# EAGLE schematic controller-r3 (EAGLE 6.6.0)
DATABASE: ./../../../../core/eagle/partsdb.txt

## Sheet 1 of 3
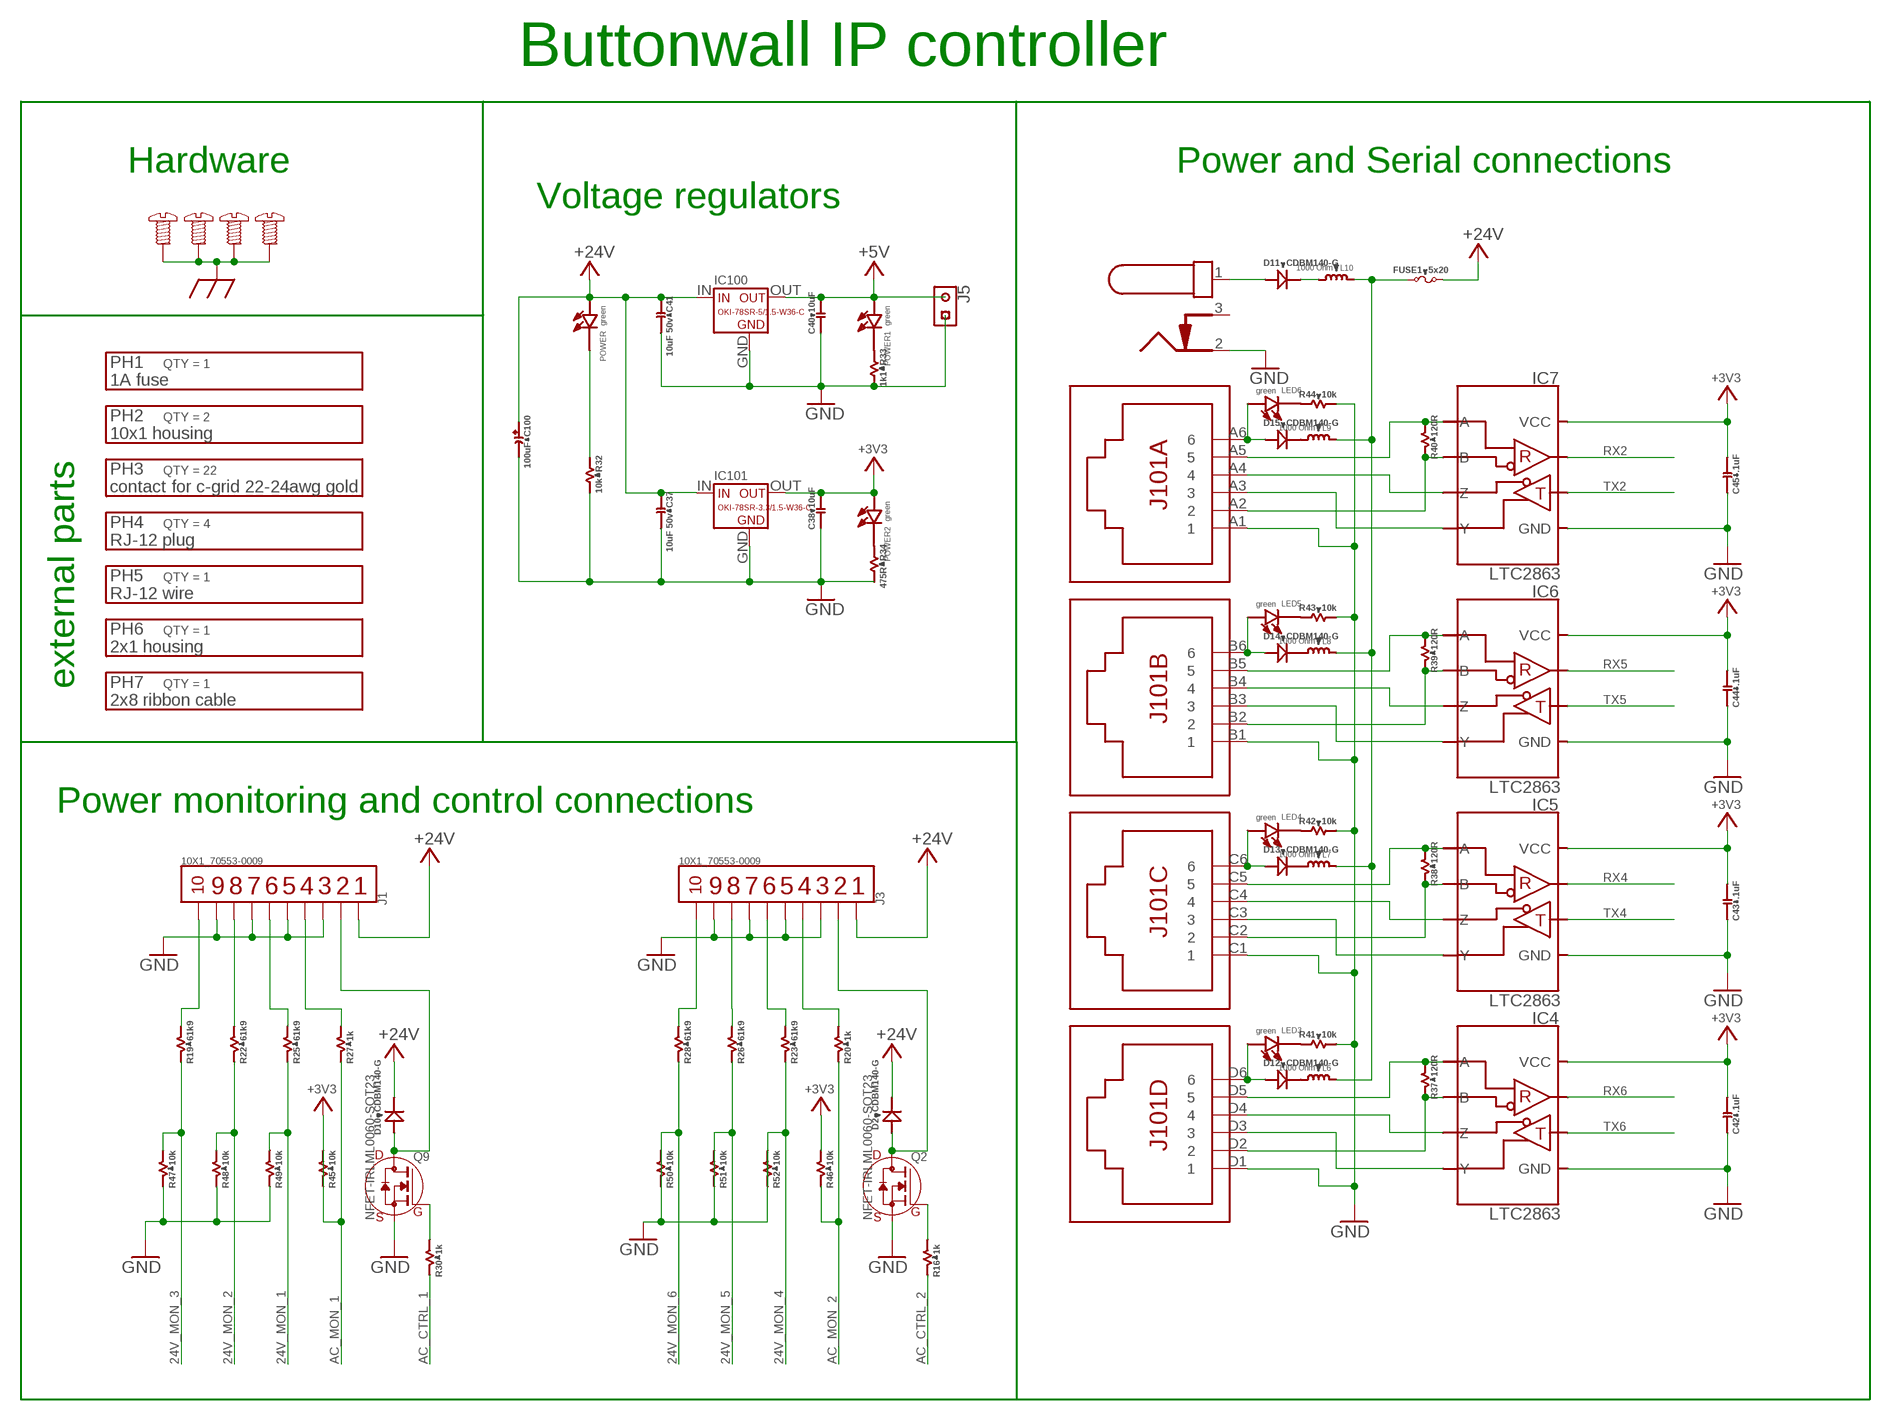
[diagram p0: schematic, sheet 1]
PH1 (BOM-PART): PARTNO: 0001.2504; QTY: 1
PH2 (BOM-PART): PARTNO: 0050579410; QTY: 2
PH3 (BOM-PART): PARTNO: 0016020103; QTY: 22
PH4 (BOM-PART): PARTNO: 940-SP-3066; QTY: 4
PH5 (BOM-PART): QTY: 1
PH6 (BOM-PART): PARTNO: 0050579402; QTY: 1
PH7 (BOM-PART): PARTNO: H3CCH-1606G; QTY: 1

### Parts
C37  10uF 50v  C1206  [C1206B]
C38  10uF  C0603  [C0603B]
C40  10uF  C0603  [C0603B]
C41  10uF 50v  C1206  [C1206B]
C42  .1uF  C0603  [C0603B]
C43  .1uF  C0603  [C0603B]
C44  .1uF  C0603  [C0603B]
C45  .1uF  C0603  [C0603B]
C100  100uF  CPOL-TH-3.5-8  [E3,5-8]
D2  CDBM140-G  D_SOD123  [SOD-123]
D10  CDBM140-G  D_SOD123  [SOD-123]
D11  CDBM140-G  D_SOD123  [SOD-123]
D12  CDBM140-G  D_SOD123  [SOD-123]
D13  CDBM140-G  D_SOD123  [SOD-123]
D14  CDBM140-G  D_SOD123  [SOD-123]
D15  CDBM140-G  D_SOD123  [SOD-123]
FUSE1  5x20  F-649  [649]
IC4  LTC2863  [SO08]
IC5  LTC2863  [SO08]
IC6  LTC2863  [SO08]
IC7  LTC2863  [SO08]
IC100  OKI-78SR-5/1.5-W36-C  [OKI-78SR-V]
IC101  OKI-78SR-3.3/1.5-W36-C  [OKI-78SR-V]
J1  10X1_70553-0009  [MOLEX_70553-(10)]
J3  10X1_70553-0009  [MOLEX_70553-(10)]
J5  1X2_70543  [MOLEX_70543-0001]
J100  PJ-102AH  DC_JACK  [PJ-102(DC_JACK)]
J101  RJ12-QUAD  [SS-666604-NF]
L6  1000 Ohm  L0603  [R0603B]
L7  1000 Ohm  L0603  [R0603B]
L8  1000 Ohm  L0603  [R0603B]
L9  1000 Ohm  L0603  [R0603B]
L10  1000 Ohm  L0603  [R0603B]
LED3  green  LED0603  [CHIPLED_0603]
LED4  green  LED0603  [CHIPLED_0603]
LED5  green  LED0603  [CHIPLED_0603]
LED6  green  LED0603  [CHIPLED_0603]
POWER  green  LED0603  [CHIPLED_0603]
POWER1  green  LED0603  [CHIPLED_0603]
POWER2  green  LED0603  [CHIPLED_0603]
Q2  NFET-IRLML0060-SOT23  [SOT-23]
Q9  NFET-IRLML0060-SOT23  [SOT-23]
R16  1k  R0603  [R0603B]
R19  61k9  R0603  [R0603B]
R20  1k  R0603  [R0603B]
R22  61k9  R0603  [R0603B]
R23  61k9  R0603  [R0603B]
R25  61k9  R0603  [R0603B]
R26  61k9  R0603  [R0603B]
R27  1k  R0603  [R0603B]
R28  61k9  R0603  [R0603B]
R30  1k  R0603  [R0603B]
R32  10k  R0603  [R0603B]
R33  1k1  R0603  [R0603B]
R34  475R  R0603  [R0603B]
R37  120R  R1206  [R1206B]
R38  120R  R1206  [R1206B]
R39  120R  R1206  [R1206B]
R40  120R  R1206  [R1206B]
R41  10k  R0603  [R0603B]
R42  10k  R0603  [R0603B]
R43  10k  R0603  [R0603B]
R44  10k  R0603  [R0603B]
R45  10k  R0603  [R0603B]
R46  10k  R0603  [R0603B]
R47  10k  R0603  [R0603B]
R48  10k  R0603  [R0603B]
R49  10k  R0603  [R0603B]
R50  10k  R0603  [R0603B]
R51  10k  R0603  [R0603B]
R52  10k  R0603  [R0603B]
SCREW1  SCREW-632-0-PSHP  [SMTPR-6-1]
SCREW2  SCREW-632-0-PSHP  [SMTPR-6-1]
SCREW3  SCREW-632-0-PSHP  [SMTPR-6-1]
SCREW4  SCREW-632-0-PSHP  [SMTPR-6-1]

### Nets
24V_MON_1: R25.1 R49.2 ; also sheet 2
24V_MON_2: R22.1 R48.2 ; also sheet 2
24V_MON_3: R19.1 R47.2 ; also sheet 2
24V_MON_4: R23.1 R52.1 ; also sheet 2
24V_MON_5: R26.1 R51.1 ; also sheet 2
24V_MON_6: R28.1 R50.1 ; also sheet 2
+3V3: C38.2 C42.2 C43.2 C44.2 C45.2 IC4.1(VCC) IC5.1(VCC) IC6.1(VCC) IC7.1(VCC) IC101.OUT POWER2.A(ANODE) R45.1 R46.2 ; also sheet 2,3
+5V: C40.2 IC100.OUT J5.2 POWER1.A(ANODE)
+24V: C37.1 C41.1 C100.+ D2.C(K) D10.C(K) FUSE1.2 IC100.IN IC101.IN J1.1 J3.1 POWER.A(ANODE)
AC_CTRL_1: R30.1 ; also sheet 2
AC_CTRL_2: R16.1 ; also sheet 2
AC_MON_1: R27.1 R45.2 ; also sheet 2
AC_MON_2: R20.1 R46.1 ; also sheet 2
CHASSIS [Earth]: SCREW1.P$1 SCREW2.P$1 SCREW3.P$1 SCREW4.P$1 ; also sheet 3
GND: C37.2 C38.1 C40.1 C41.2 C42.1 C43.1 C44.1 C45.1 C100.- IC4.4(GND) IC5.4(GND) IC6.4(GND) IC7.4(GND) IC100.GND IC101.GND J1.3 J1.5 J1.7 J1.9 J3.3 J3.5 J3.7 J3.9 J5.1 J100.2(SLEEVE) J101.A1 J101.B1 J101.C1 J101.D1 Q2.2(S) Q9.2(S) R32.2 R33.2 R34.2 R41.2 R42.2 R43.2 R44.2 R47.1 R48.1 R49.1 R50.2 R51.2 R52.2 ; also sheet 2,3
N$7: IC7.7(B) J101.A2 R40.1
N$17: POWER1.C(CATHODE) R33.1
N$22: IC7.8(A) J101.A5 R40.2
N$23: D15.C(K) L9.2
N$24: POWER.C(CATHODE) R32.1
N$25: IC7.5(Y) J101.A3
N$29: IC7.6(Z) J101.A4
N$32: IC6.7(B) J101.B2 R39.1
N$36: IC6.8(A) J101.B5 R39.2
N$38: D15.A J101.A6 LED6.A(ANODE)
N$39: IC6.5(Y) J101.B3
N$40: IC6.6(Z) J101.B4
N$41: IC5.7(B) J101.C2 R38.1
N$43: IC5.8(A) J101.C5 R38.2
N$44: D14.C(K) L8.2
N$45: IC5.5(Y) J101.C3
N$46: IC5.6(Z) J101.C4
N$47: IC4.7(B) J101.D2 R37.1
N$48: IC4.8(A) J101.D5 R37.2
N$49: D14.A J101.B6 LED5.A(ANODE)
N$50: IC4.5(Y) J101.D3
N$51: IC4.6(Z) J101.D4
N$52: J1.4 R27.2
N$53: J1.10 R19.2
N$54: J1.8 R22.2
N$55: J1.6 R25.2
N$60: D10.A J1.2 Q9.3(D)
N$61: Q9.1(G) R30.2
N$62: D13.C(K) L7.2
N$63: D13.A J101.C6 LED4.A(ANODE)
N$64: D12.C(K) L6.2
N$65: D12.A J101.D6 LED3.A(ANODE)
N$66: D11.C(K) L10.2
N$67: D11.A J100.1(CENTER)
N$68: J3.10 R28.2
N$70: J3.8 R26.2
N$72: J3.6 R23.2
N$74: J3.4 R20.2
N$76: D2.A J3.2 Q2.3(D)
N$77: Q2.1(G) R16.2
N$78: POWER2.C(CATHODE) R34.1
N$80: FUSE1.1 L6.1 L7.1 L8.1 L9.1 L10.1
N$84: LED5.C(CATHODE) R43.1
N$85: LED6.C(CATHODE) R44.1
N$86: LED4.C(CATHODE) R42.1
N$87: LED3.C(CATHODE) R41.1
RX2: IC7.2(RO) ; also sheet 2
RX4: IC5.2(RO) ; also sheet 2
RX5: IC6.2(RO) ; also sheet 2
RX6: IC4.2(RO) ; also sheet 2
TX2: IC7.3(DI) ; also sheet 2
TX4: IC5.3(DI) ; also sheet 2
TX5: IC6.3(DI) ; also sheet 2
TX6: IC4.3(DI) ; also sheet 2
Unconnected: J100.3(SLV_SHNT)

### Notes on the sheet
- Buttonwall IP controller
- Hardware | Power and Serial connections
- Voltage regulators
- external parts
- Power monitoring and control connections

## Sheet 2 of 3
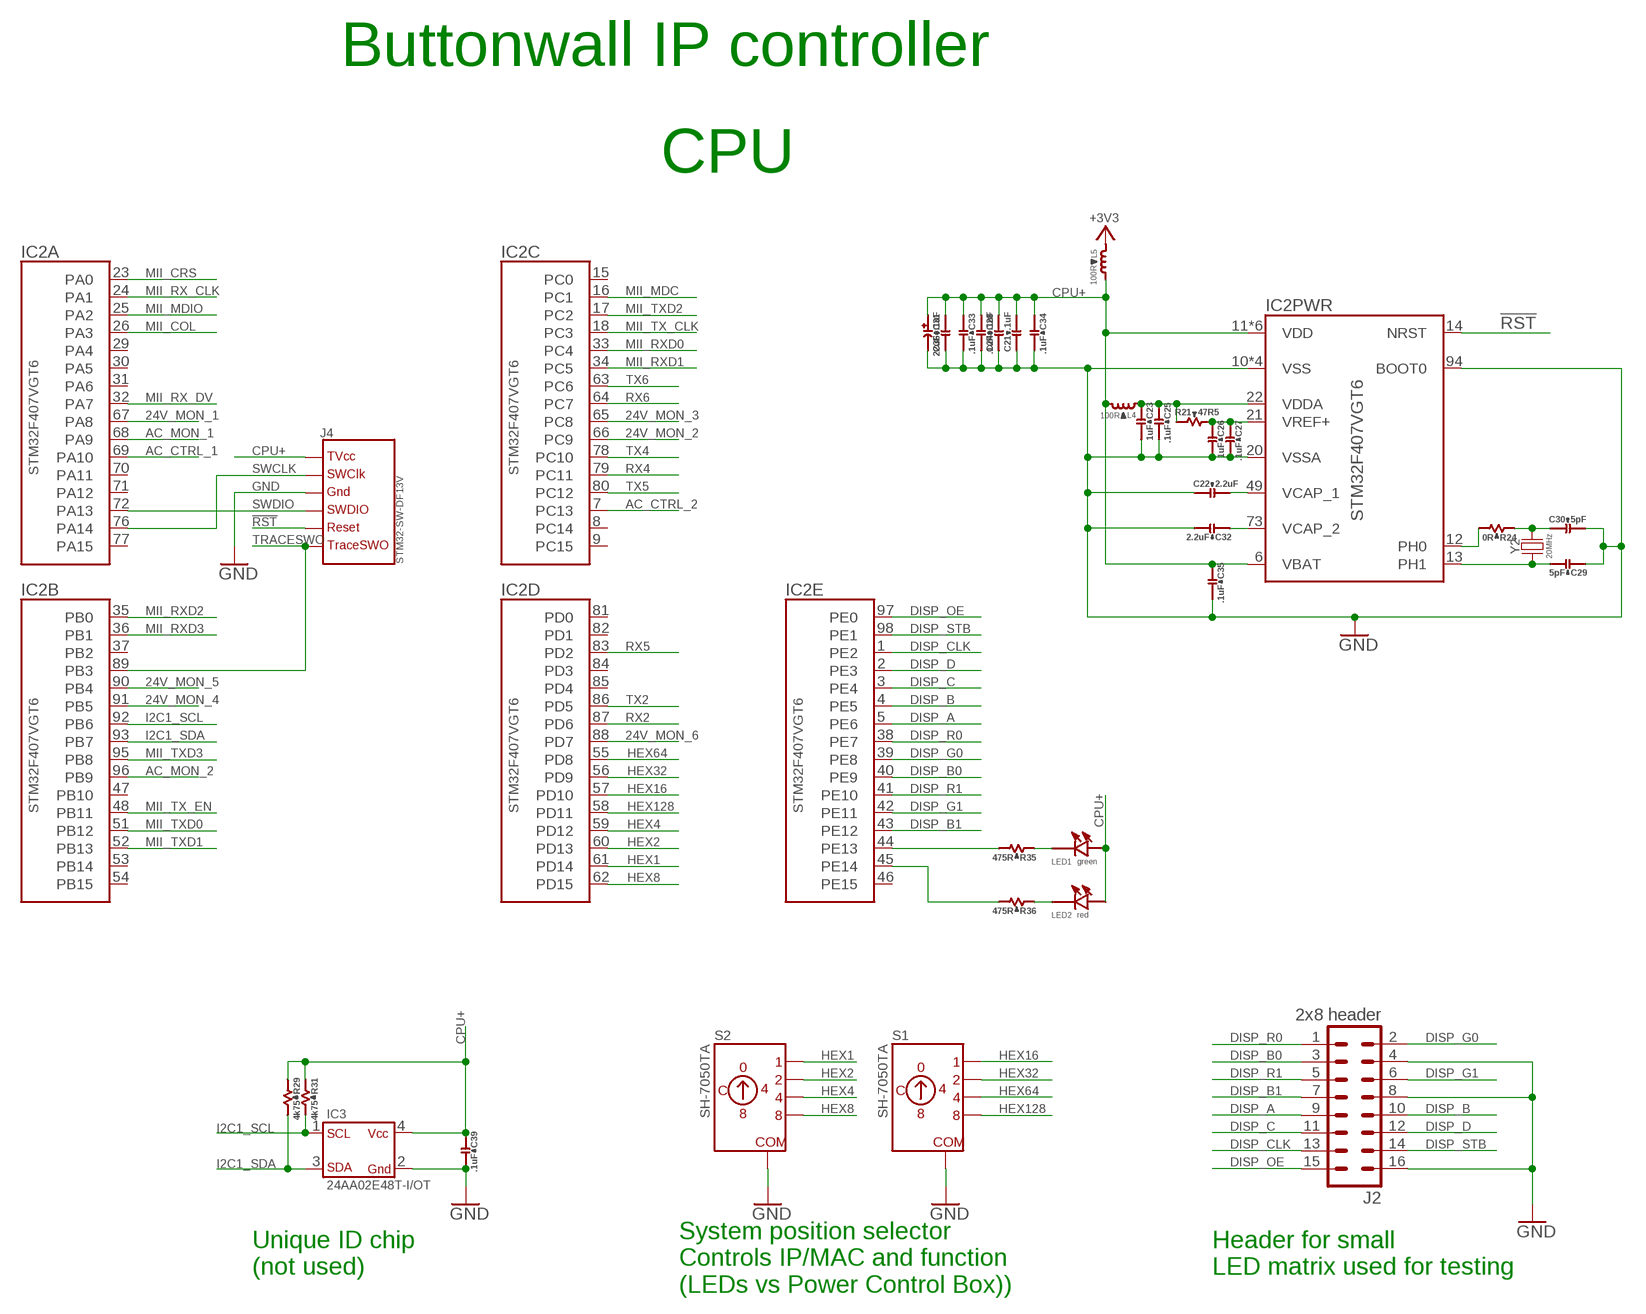
[diagram p1: schematic, sheet 2]

### Parts
C21  .1uF  C0603  [C0603B]
C22  2.2uF  C0603  [C0603B]
C23  1uF  C0603  [C0603B]
C24  .1uF  C0603  [C0603B]
C25  .1uF  C0603  [C0603B]
C26  1uF  C0603  [C0603B]
C27  .1uF  C0603  [C0603B]
C28  .1uF  C0603  [C0603B]
C29  5pF  C0603  [C0603B]
C30  5pF  C0603  [C0603B]
C31  22uF  CPOL-B/3528  [B/3528-21R]
C32  2.2uF  C0603  [C0603B]
C33  .1uF  C0603  [C0603B]
C34  .1uF  C0603  [C0603B]
C35  .1uF  C0603  [C0603B]
C36  .1uF  C0603  [C0603B]
C39  .1uF  C0603  [C0603B]
IC2  STM32F407VGT6  STM32F407V_T  [LQFP-100]
IC3  24AA02E48T-I/OT  [SOT-23-5]
J2  2x8 header  ML16  [ML16]
J4  STM32-SW-DF13V  [DF13-6P-1.25V]
L4  100R  L0603  [R0603B]
L5  100R  L0603  [R0603B]
LED1  green  LED0603  [CHIPLED_0603]
LED2  red  LED0603  [CHIPLED_0603]
R21  47R5  R0603  [R0603B]
R24  0R  R0603  [R0603B]
R29  4k75  R0603  [R0603B]
R31  4k75  R0603  [R0603B]
R35  475R  R0603  [R0603B]
R36  475R  R0603  [R0603B]
S1  SH-7050TA  HEXROTARY  [SH-7050TA]
S2  SH-7050TA  HEXROTARY  [SH-7050TA]
Y2  20MHz  XTAL-2_5X3.2  [5X3.2]

### Nets
24V_MON_1: IC2.67(A:PA8) ; also sheet 1
24V_MON_2: IC2.66(C:PC9) ; also sheet 1
24V_MON_3: IC2.65(C:PC8) ; also sheet 1
24V_MON_4: IC2.91(B:PB5) ; also sheet 1
24V_MON_5: IC2.90(B:PB4) ; also sheet 1
24V_MON_6: IC2.88(D:PD7) ; also sheet 1
!RST: IC2.14(PWR:NRST) J4.5(RESET)
+3V3: L5.1 ; also sheet 1,3
AC_CTRL_1: IC2.69(A:PA10) ; also sheet 1
AC_CTRL_2: IC2.7(C:PC13) ; also sheet 1
AC_MON_1: IC2.68(A:PA9) ; also sheet 1
AC_MON_2: IC2.96(B:PB9) ; also sheet 1
CPU+: C21.2 C24.2 C28.1 C31.+ C33.1 C34.1 C35.1 C36.2 C39.1 IC2.6(PWR:VBAT) IC2.11(PWR:VDD) IC2.19(PWR:VDD) IC2.28(PWR:VDD) IC2.50(PWR:VDD) IC2.75(PWR:VDD) IC2.100(PWR:VDD) IC3.4(VCC) J4.1(TVCC) L4.2 L5.2 LED1.A(ANODE) LED2.A(ANODE) R29.1 R31.1
DISP_A: IC2.5(E:PE6) J2.9
DISP_B: IC2.4(E:PE5) J2.10
DISP_B0: IC2.40(E:PE9) J2.3
DISP_B1: IC2.43(E:PE12) J2.7
DISP_C: IC2.3(E:PE4) J2.11
DISP_CLK: IC2.1(E:PE2) J2.13
DISP_D: IC2.2(E:PE3) J2.12
DISP_G0: IC2.39(E:PE8) J2.2
DISP_G1: IC2.42(E:PE11) J2.6
DISP_OE: IC2.97(E:PE0) J2.15
DISP_R0: IC2.38(E:PE7) J2.1
DISP_R1: IC2.41(E:PE10) J2.5
DISP_STB: IC2.98(E:PE1) J2.14
GND: C21.1 C22.1 C23.2 C24.1 C25.2 C26.2 C27.2 C28.2 C29.1 C30.2 C31.- C32.2 C33.2 C34.2 C35.2 C36.1 C39.2 IC2.10(PWR:VSS) IC2.20(PWR:VSSA) IC2.27(PWR:VSS) IC2.74(PWR:VSS) IC2.94(PWR:BOOT0) IC2.99(PWR:VSS) IC3.2(GND) J2.4 J2.8 J2.16 J4.3(GND) S1.C(COM) S1.C@2(COM) S2.C(COM) S2.C@2(COM) ; also sheet 1,3
HEX1: IC2.61(D:PD14) S2.1
HEX2: IC2.60(D:PD13) S2.2
HEX4: IC2.59(D:PD12) S2.4
HEX8: IC2.62(D:PD15) S2.8
HEX16: IC2.57(D:PD10) S1.1
HEX32: IC2.56(D:PD9) S1.2
HEX64: IC2.55(D:PD8) S1.4
HEX128: IC2.58(D:PD11) S1.8
I2C1_SCL: IC2.92(B:PB6) IC3.1(SCL) R31.2
I2C1_SDA: IC2.93(B:PB7) IC3.3(SDA) R29.2
MII_COL: IC2.26(A:PA3) ; also sheet 3
MII_CRS: IC2.23(A:PA0) ; also sheet 3
MII_MDC: IC2.16(C:PC1) ; also sheet 3
MII_MDIO: IC2.25(A:PA2) ; also sheet 3
MII_RX_CLK: IC2.24(A:PA1) ; also sheet 3
MII_RX_DV: IC2.32(A:PA7) ; also sheet 3
MII_RXD0: IC2.33(C:PC4) ; also sheet 3
MII_RXD1: IC2.34(C:PC5) ; also sheet 3
MII_RXD2: IC2.35(B:PB0) ; also sheet 3
MII_RXD3: IC2.36(B:PB1) ; also sheet 3
MII_TX_CLK: IC2.18(C:PC3) ; also sheet 3
MII_TX_EN: IC2.48(B:PB11) ; also sheet 3
MII_TXD0: IC2.51(B:PB12) ; also sheet 3
MII_TXD1: IC2.52(B:PB13) ; also sheet 3
MII_TXD2: IC2.17(C:PC2) ; also sheet 3
MII_TXD3: IC2.95(B:PB8) ; also sheet 3
N$1: IC2.12(PWR:PH0) R24.2
N$2: C29.2 IC2.13(PWR:PH1) Y2.1
N$3: C30.1 R24.1 Y2.2
N$4: C22.2 IC2.49(PWR:VCAP_1)
N$5: C32.1 IC2.73(PWR:VCAP_2)
N$6: C23.1 C25.1 IC2.22(PWR:VDDA) L4.1 R21.1
N$8: C26.1 C27.1 IC2.21(PWR:VREF+) R21.2
N$79: LED1.C(CATHODE) R35.1
N$81: LED2.C(CATHODE) R36.1
N$82: IC2.45(E:PE14) R36.2
N$83: IC2.44(E:PE13) R35.2
RX2: IC2.87(D:PD6) ; also sheet 1
RX4: IC2.79(C:PC11) ; also sheet 1
RX5: IC2.83(D:PD2) ; also sheet 1
RX6: IC2.64(C:PC7) ; also sheet 1
SWCLK: IC2.76(A:PA14) J4.2(SWCLK)
SWDIO: IC2.72(A:PA13) J4.4(SWDIO)
TRACESWO: IC2.89(B:PB3) J4.6(TRACESWO)
TX2: IC2.86(D:PD5) ; also sheet 1
TX4: IC2.78(C:PC10) ; also sheet 1
TX5: IC2.80(C:PC12) ; also sheet 1
TX6: IC2.63(C:PC6) ; also sheet 1
Unconnected: IC2.8(C:PC14) IC2.9(C:PC15) IC2.15(C:PC0) IC2.29(A:PA4) IC2.30(A:PA5) IC2.31(A:PA6) IC2.37(B:PB2) IC2.46(E:PE15) IC2.47(B:PB10) IC2.53(B:PB14) IC2.54(B:PB15) IC2.70(A:PA11) IC2.71(A:PA12) IC2.77(A:PA15) IC2.81(D:PD0) IC2.82(D:PD1) IC2.84(D:PD3) IC2.85(D:PD4)

### Notes on the sheet
- Buttonwall IP controller
- CPU
- Unique ID chip
  (not used)
- Header for small
  LED matrix used for testing
- System position selector
  Controls IP/MAC and function
  (LEDs vs Power Control Box))

## Sheet 3 of 3
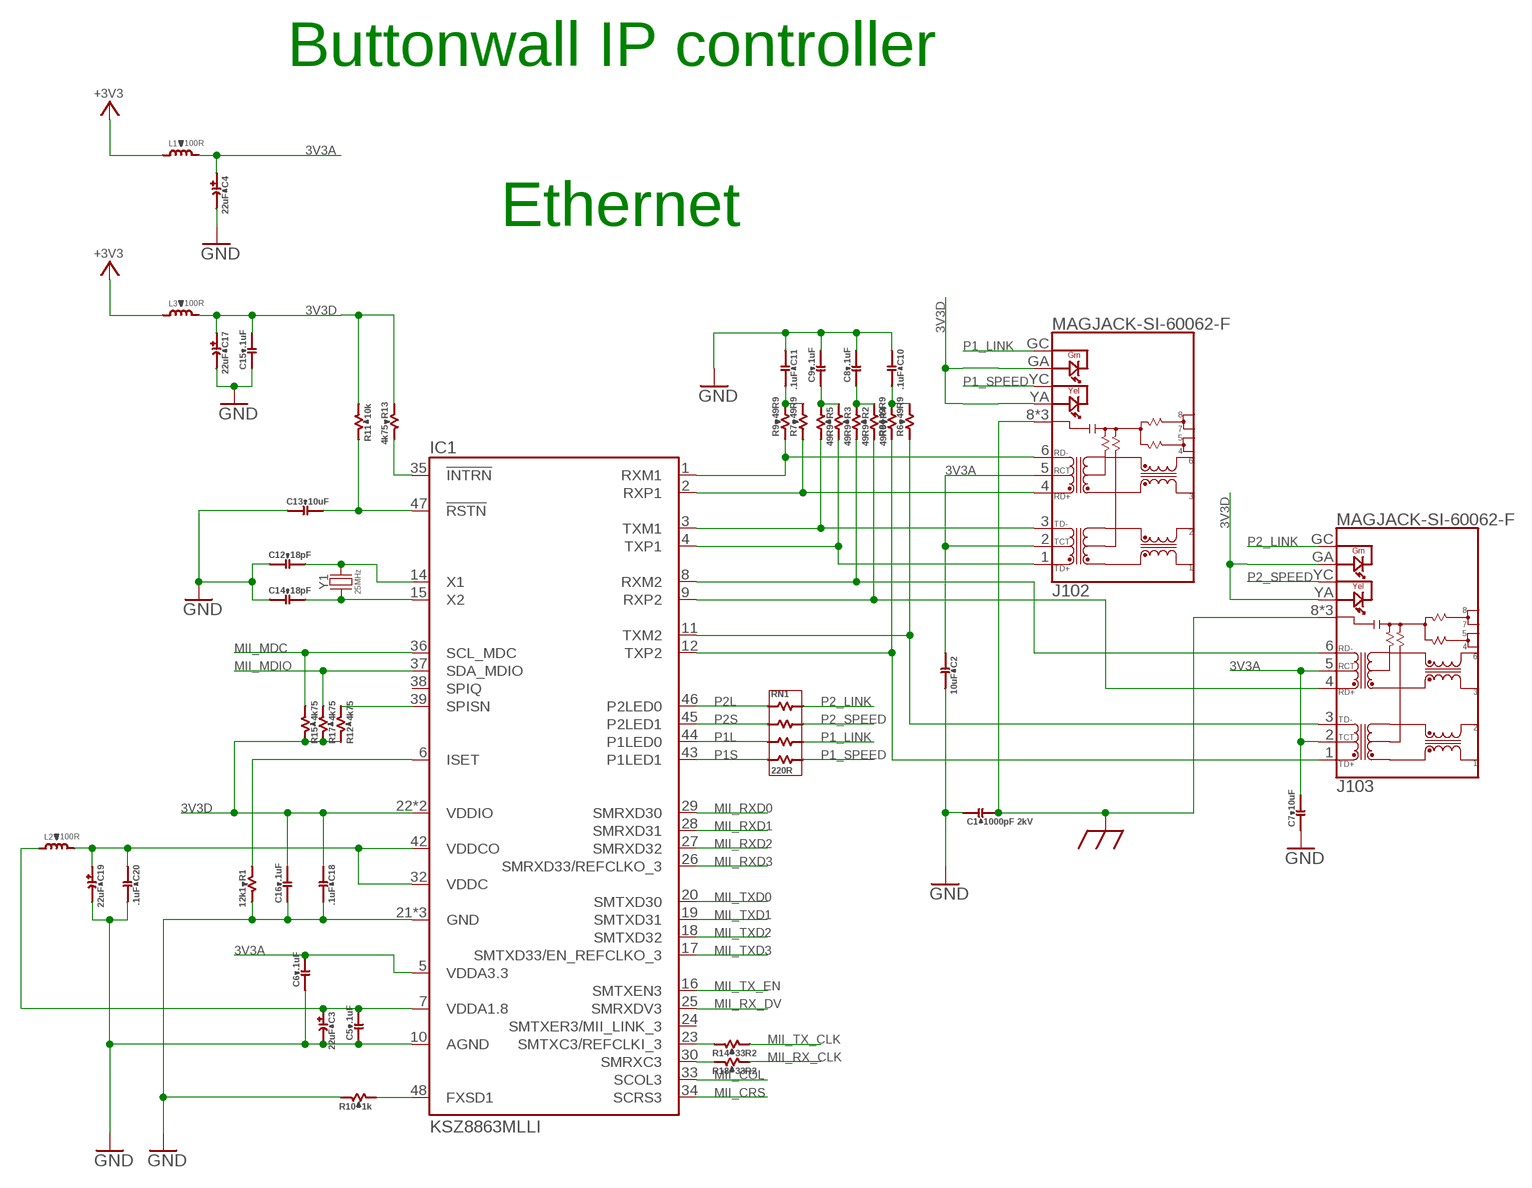
[diagram p2: schematic, sheet 3]

### Parts
C1  1000pF 2kV  C1206  [C1206B]
C2  10uF  C0603  [C0603B]
C3  22uF  CPOL-B/3528  [B/3528-21R]
C4  22uF  CPOL-B/3528  [B/3528-21R]
C5  .1uF  C0603  [C0603B]
C6  .1uF  C0603  [C0603B]
C7  10uF  C0603  [C0603B]
C8  .1uF  C0603  [C0603B]
C9  .1uF  C0603  [C0603B]
C10  .1uF  C0603  [C0603B]
C11  .1uF  C0603  [C0603B]
C12  18pF  C0603  [C0603B]
C13  10uF  C0603  [C0603B]
C14  18pF  C0603  [C0603B]
C15  .1uF  C0603  [C0603B]
C16  .1uF  C0603  [C0603B]
C17  22uF  CPOL-B/3528  [B/3528-21R]
C18  .1uF  C0603  [C0603B]
C19  22uF  CPOL-B/3528  [B/3528-21R]
C20  .1uF  C0603  [C0603B]
IC1  KSZ8863MLLI  [TQFP48]
J102  MAGJACK-SI-60062-F  [SI-60062-F]
J103  MAGJACK-SI-60062-F  [SI-60062-F]
L1  100R  L0603  [R0603B]
L2  100R  L0603  [R0603B]
L3  100R  L0603  [R0603B]
R1  12k1  R0603  [R0603B]
R2  49R9  R0603  [R0603B]
R3  49R9  R0603  [R0603B]
R4  49R9  R0603  [R0603B]
R5  49R9  R0603  [R0603B]
R6  49R9  R0603  [R0603B]
R7  49R9  R0603  [R0603B]
R8  49R9  R0603  [R0603B]
R9  49R9  R0603  [R0603B]
R10  1k  R0603  [R0603B]
R11  10k  R0603  [R0603B]
R12  4k75  R0603  [R0603B]
R13  4k75  R0603  [R0603B]
R14  33R2  R0603  [R0603B]
R15  4k75  R0603  [R0603B]
R17  4k75  R0603  [R0603B]
R18  33R2  R0603  [R0603B]
RN1  220R  R4_742C  [CTS_742-4]
Y1  25MHz  XTAL-2_5X3.2  [5X3.2]

### Nets
3V3A: C2.1 C4.+ C6.2 C7.2 IC1.5(VDDA3.3) J102.2(TCT) J102.5(RCT) J103.2(TCT) J103.5(RCT) L1.2
3V3D: C15.2 C16.2 C17.+ C18.1 IC1.22(VDDIO) IC1.40(VDDIO) J102.GA J102.YA J103.GA J103.YA L3.2 R11.2 R12.1 R13.1 R15.1 R17.1
+3V3: L1.1 L3.1 ; also sheet 1,2
CHASSIS [Earth]: C1.2 J102.8(CHASSIS) J102.P$1(CHASSIS) J102.P$2(CHASSIS) J103.8(CHASSIS) J103.P$1(CHASSIS) J103.P$2(CHASSIS) ; also sheet 1
GND: C1.1 C2.2 C3.- C4.- C5.1 C6.1 C7.1 C8.2 C9.2 C10.1 C11.1 C12.1 C13.1 C14.1 C15.1 C16.1 C17.- C18.2 C19.- C20.2 IC1.10(AGND) IC1.21(GND) IC1.31(GND) IC1.41(GND) R1.2 R10.1 ; also sheet 1,2
MII_COL: IC1.33(SCOL3) ; also sheet 2
MII_CRS: IC1.34(SCRS3) ; also sheet 2
MII_MDC: IC1.36(SCL_MDC) R15.2 ; also sheet 2
MII_MDIO: IC1.37(SDA_MDIO) R17.2 ; also sheet 2
MII_RX_CLK: R18.2 ; also sheet 2
MII_RX_DV: IC1.25(SMRXDV3) ; also sheet 2
MII_RXD0: IC1.29(SMRXD30) ; also sheet 2
MII_RXD1: IC1.28(SMRXD31) ; also sheet 2
MII_RXD2: IC1.27(SMRXD32) ; also sheet 2
MII_RXD3: IC1.26(SMRXD33/REFCLKO_3) ; also sheet 2
MII_TX_CLK: R14.2 ; also sheet 2
MII_TX_EN: IC1.16(SMTXEN3) ; also sheet 2
MII_TXD0: IC1.20(SMTXD30) ; also sheet 2
MII_TXD1: IC1.19(SMTXD31) ; also sheet 2
MII_TXD2: IC1.18(SMTXD32) ; also sheet 2
MII_TXD3: IC1.17(SMTXD33/EN_REFCLKO_3) ; also sheet 2
N$9: C11.2 R7.2 R9.2
N$10: C9.1 R3.1 R5.1
N$11: C8.1 R2.1 R4.1
N$12: C10.2 R6.2 R8.2
N$13: IC1.30(SMRXC3) R18.1
N$14: IC1.1(RXM1) J102.6(RD-) R9.1
N$15: IC1.2(RXP1) J102.4(RD+) R7.1
N$16: IC1.3(TXM1) J102.3(TD-) R5.2
N$18: IC1.8(RXM2) J103.6(RD-) R2.2
N$19: IC1.9(RXP2) J103.4(RD+) R4.2
N$20: IC1.11(TXM2) J103.3(TD-) R6.1
N$21: IC1.12(TXP2) J103.1(TD+) R8.1
N$26: IC1.23(SMTXC3/REFCLKI_3) R14.1
N$27: C14.2 IC1.15(X2) Y1.1
N$28: C12.2 IC1.14(X1) Y1.2
N$30: IC1.35(!INTRN) R13.2
N$31: C13.2 IC1.47(!RSTN) R11.1
N$33: C3.+ C5.2 IC1.7(VDDA1.8) L2.1
N$34: IC1.48(FXSD1) R10.2
N$35: IC1.6(ISET) R1.1
N$37: IC1.39(SPISN) R12.2
N$42: IC1.4(TXP1) J102.1(TD+) R3.2
P1_LINK: J102.GC RN1.C2
P1_SPEED: J102.YC RN1.D2
P1L: IC1.44(P1LED0) RN1.C1
P1S: IC1.43(P1LED1) RN1.D1
P2_LINK: J103.GC RN1.A2
P2_SPEED: J103.YC RN1.B2
P2L: IC1.46(P2LED0) RN1.A1
P2S: IC1.45(P2LED1) RN1.B1
VDDC: C19.+ C20.1 IC1.32(VDDC) IC1.42(VDDCO) L2.2
Unconnected: IC1.24(SMTXER3/MII_LINK_3) IC1.38(SPIQ)

### Notes on the sheet
- Buttonwall IP controller
- Ethernet

## Library data of the parts
C1 = buttonwall:C: Basic non-polarized capacitor; PARTNO: 202R18W102KV4E
C2 C7 C13 C38 C40 = buttonwall:C: Basic non-polarized capacitor; PARTNO: C1608X6S1A106M080AC
C3 C4 C17 C19 C31 = rcl-cust:CPOL: Polarized capacitors; PARTNO: 293D226X96R3B2TE3
C5 C6 C8-C11 C15 C16 C18 C20 C21 C24 C25 C27 C28 C33-C36 C39 C42-C45 = buttonwall:C: Basic non-polarized capacitor; PARTNO: CGA3E2X7R1H104K080AA
C12 C14 = buttonwall:C: Basic non-polarized capacitor; PARTNO: CGA3E2C0G1H180J080AA
C22 C32 = buttonwall:C: Basic non-polarized capacitor; PARTNO: C1608X5R1V225K080AC
C23 C26 = buttonwall:C: Basic non-polarized capacitor; PARTNO: CGA3E3X5R1H105K080AB
C29 C30 = buttonwall:C: Basic non-polarized capacitor; PARTNO: CGA3E2C0G1H050C080AA
C37 C41 = buttonwall:C: Basic non-polarized capacitor; PARTNO: CL31A106KBHNNNE
C100 = buttonwall:CPOL: Polarized capacitors; PARTNO: EEU-FM1H101
D2 D10-D15 = diode:D_; PARTNO: CDBM140-G
FUSE1 = buttonwall:F: Fuse or Fuseholder; PARTNO: 64900001039
IC1 = buttonwall:KSZ8863MLL: Integrated 3-Port 10/100 Managed Switch with two 10/100BASE-T/TX transceivers and on MII interface; PARTNO: KSZ8863MLLI
IC2 = micros:STM32F40*: ARM Cortex-M4 32b MCU+FPU, 210DMIPS, up to 1MB Flash/192+4KB RAM, USB OTG HS/FS, Ethernet, 17 TIMs, 3 ADCs, 15 comm. interfaces & camera; PARTNO: STM32F407VGT6
IC3 = Memory:24AA02E48: 24AA02E48T-I/OTCT-ND; PARTNO: 24AA02E48T-I/OT
IC4-IC7 = buttonwall:LTC2863: ±60V Fault Protected 3V to 5.5V RS485/RS422 Transceivers; PARTNO: LTC2863IS8-1#PBF
IC100 = regulators:OKI-78SR-*-: Fixed Output 1.5A SIP DC/DC Converter input cap: 10-22uF ceramic (GRM32 etc.) or polymer rated for twice the input voltage output cap: none required but 10-47uF similar grade to input can reduce ripple; PARTNO: OKI-78SR-5/1.5-W36-C
IC101 = regulators:OKI-78SR-*-: Fixed Output 1.5A SIP DC/DC Converter input cap: 10-22uF ceramic (GRM32 etc.) or polymer rated for twice the input voltage output cap: none required but 10-47uF similar grade to input can reduce ripple; PARTNO: OKI-78SR-3.3/1.5-W36-C
J1 J3 = con-header:10X1; PARTNO: 0705530009
J2 = con-harting-ml:ML16: HARTING; OC_FARNELL: unknown; OC_NEWARK: unknown; PARTNO: SBH11-PBPC-D08-ST-BK
J4 = con-header:STM32-SW: Programming header for single wire programming interface of the STM32 family of processor by ST; PARTNO: DF13C-6P-1.25V(20)
J5 = con-header:1X2; PARTNO: 0705430001
J100 = con-barrel:DC_JACK: DC Power Jack; PARTNO: PJ-102AH
J101 = buttonwall:RJ12-QUAD: quad 6p6c RJ modular jack; PARTNO: SS-666604-NF
J102 J103 = buttonwall:MAGJACK: 10/100BT Vertical Shielded RJ45 Jack with integrated magnetics 1CT:1CT turn ratio 350uH inductance, 1.2 Ohms DC resistance; PARTNO: SI-60062-F
L1-L5 = buttonwall:L; PARTNO: MPZ1608S101A
L6-L10 = buttonwall:L; PARTNO: MMZ1608R102A
LED1 LED3-LED6 POWER POWER1 POWER2 = LED:LED: Basic LED; PARTNO: LTST-C190KGKT
LED2 = LED:LED: Basic LED; PARTNO: LTST-C190KRKT
Q2 Q9 = transistor:NFET-*: Single N-channel MOSFET; IMAX: 2.7A@10Vgs; PARTNO: IRLML0060TRPBF; QGATE: 2.5n@4.5Vgs; RDS: 116m@4.5Vgs; VDS: 60
R1 = buttonwall:R: Basic resistor; PARTNO: CRCW060312K1FKEA
R2-R9 = buttonwall:R: Basic resistor; PARTNO: CRCW060349R9FKEA
R10 R16 R20 R27 R30 = buttonwall:R: Basic resistor; PARTNO: CRCW06031K00FKEA
R11 R32 R41-R52 = buttonwall:R: Basic resistor; PARTNO: CRCW060310K0FKEA
R12 R13 R15 R17 R29 R31 = buttonwall:R: Basic resistor; PARTNO: CRCW06034K75FKEA
R14 R18 = buttonwall:R: Basic resistor; PARTNO: CRCW060333R2FKEA
R19 R22 R23 R25 R26 R28 = buttonwall:R: Basic resistor; PARTNO: CRCW060361K9FKEA
R21 = buttonwall:R: Basic resistor; PARTNO: CRCW060347R5FKEA
R24 = buttonwall:R: Basic resistor; PARTNO: CRCW06030000Z0EA
R33 = buttonwall:R: Basic resistor; PARTNO: CRCW06031K10FKEA
R34-R36 = buttonwall:R: Basic resistor; PARTNO: CRCW0603475RFKEA
R37-R40 = buttonwall:R: Basic resistor; PARTNO: CRCW1206120RFKEA
RN1 = rcl-cust:R4: Resistor array with 4 isolated resistors. CTS_741 rated at 63 mW per resistor; PARTNO: 742C083221JP
S1 S2 = switch:HEXROTARY: Rotary hexidecimal dip switch; PARTNO: SH-7050TA
SCREW1-SCREW4 = buttonwall:SCREW-
Y1 = crystal:XTAL-2: 2 terminal crystal; PARTNO: 7A-25.000MAHE-T
Y2 = crystal:XTAL-2: 2 terminal crystal; PARTNO: 7A-20.000MAHE-T

## Net classes
1 Earth: clearance 0.406 mm